# EAGLE design SparkFun_FT245-Breakout (EAGLE 7.2.0)
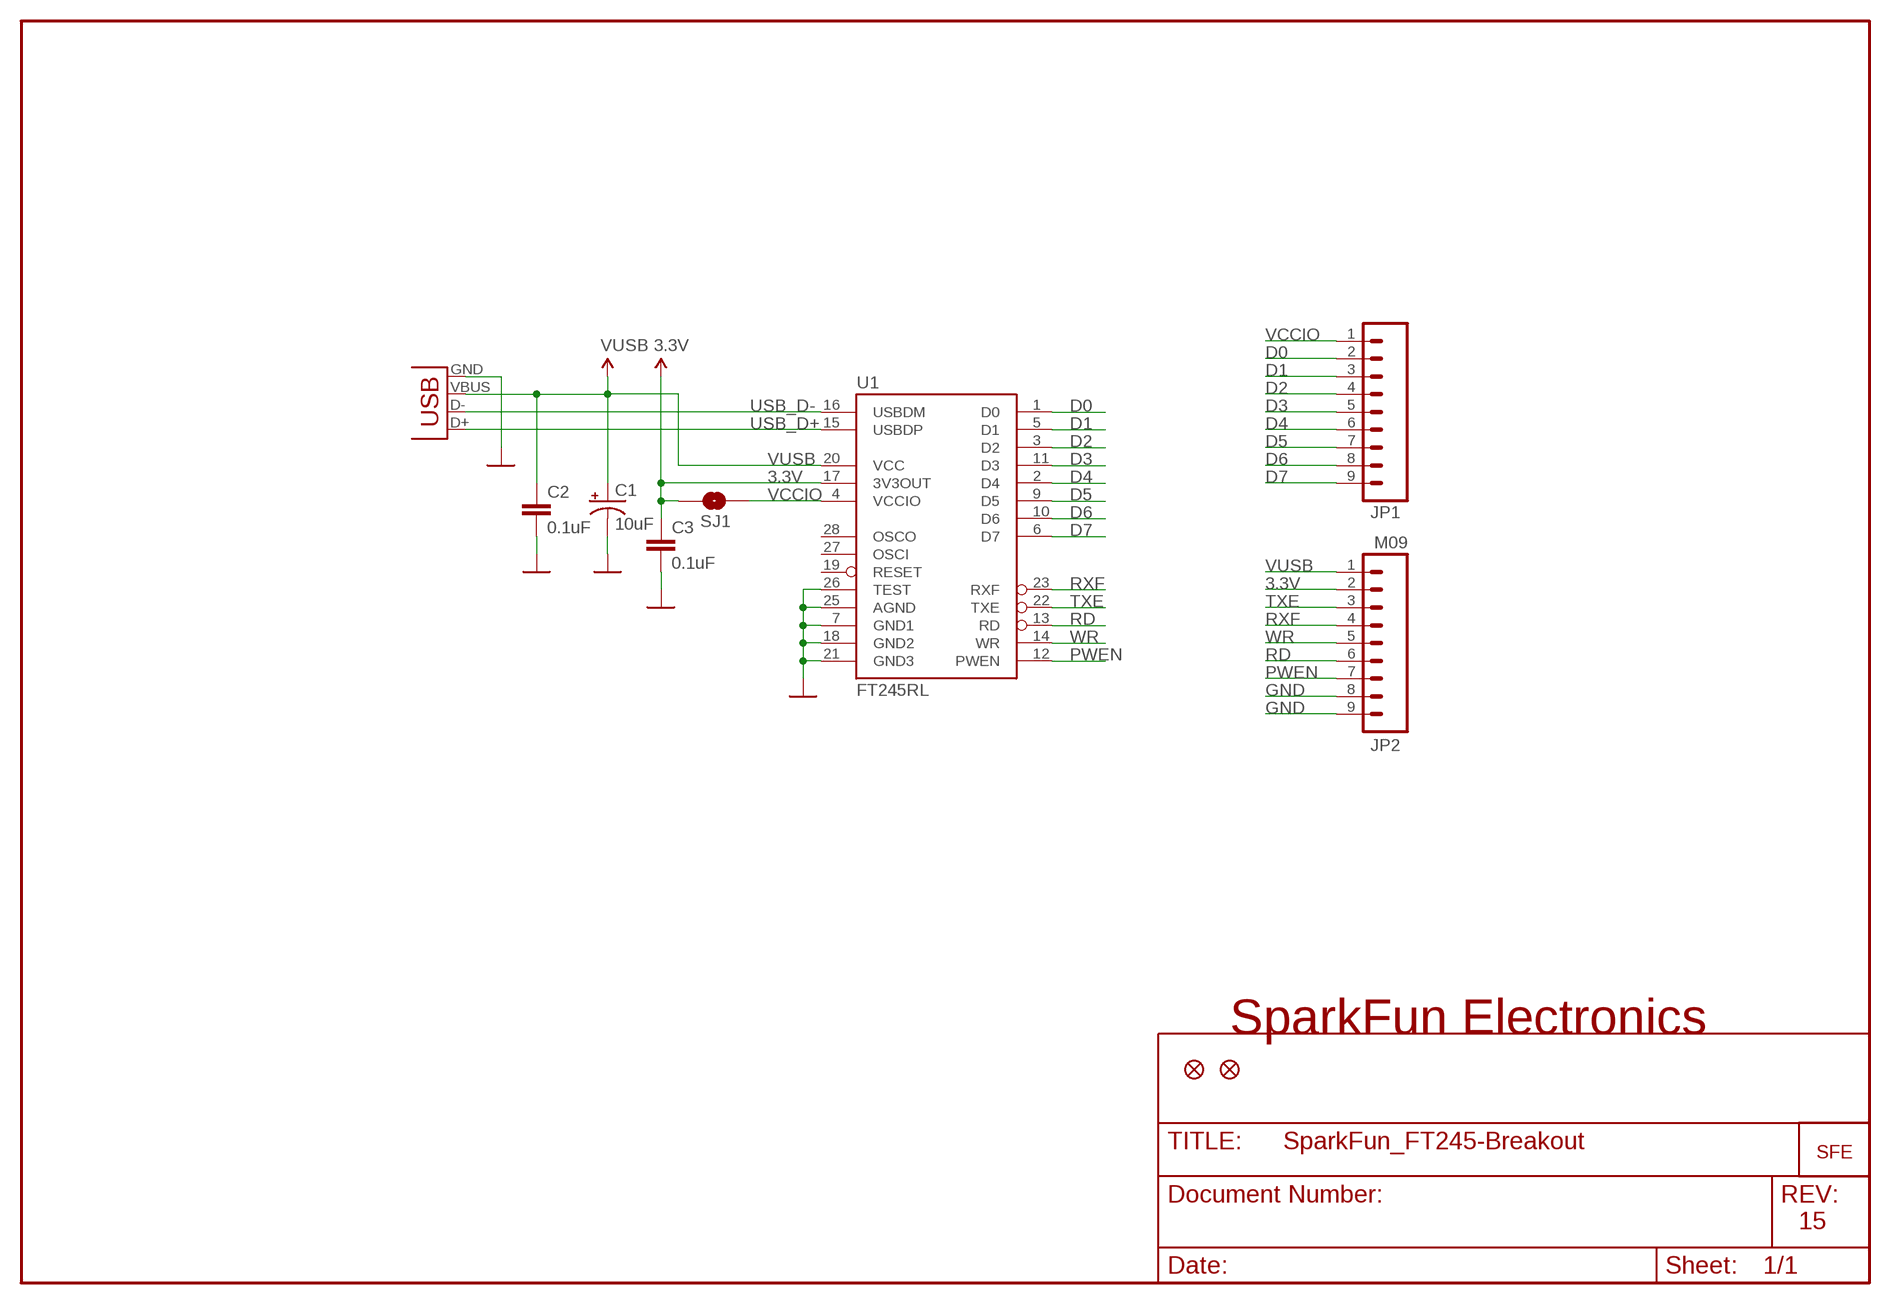
[diagram p0: schematic, sheet 1]

## Parts
C1  10uF  CAP_POL1206  [CPOL_1206]
C2  0.1uF  CAP0402-CAP  [0402-CAP]
C3  0.1uF  CAP0402-CAP  [0402-CAP]
JP1  M09  [1X09]
JP2  M09  [1X09]
JP3  FIDUCIAL1X2  [FIDUCIAL-1X2]
JP4  FIDUCIAL1X2  [FIDUCIAL-1X2]
SJ1  SOLDERJUMPERNC2  [SJ_2S-NOTRACE]
U1  FT245RL  [SSOP28DB]
U$1  LOGO-SFENEW  [SFE-NEW-WEBLOGO]
X2  USBSMD  [USB-MINIB]

## Nets
3.3V: C3.1 JP2.2 SJ1.1 U1.17(3V3OUT)
D0: JP1.2 U1.1(D0)
D1: JP1.3 U1.5(D1)
D2: JP1.4 U1.3(D2)
D3: JP1.5 U1.11(D3)
D4: JP1.6 U1.2(D4)
D5: JP1.7 U1.9(D5)
D6: JP1.8 U1.10(D6)
D7: JP1.9 U1.6(D7)
GND [power]: C1.C(-) C2.2 C3.2 JP2.8 JP2.9 U1.7(GND1) U1.18(GND2) U1.21(GND3) U1.25(AGND) U1.26(TEST) X2.GND
PWEN: JP2.7 U1.12(PWEN)
RD: JP2.6 U1.13(RD)
RXF: JP2.4 U1.23(RXF)
TXE: JP2.3 U1.22(TXE)
USB_D+: U1.15(USBDP) X2.D+
USB_D-: U1.16(USBDM) X2.D-
VCCIO: JP1.1 SJ1.2 U1.4(VCCIO)
VUSB [power]: C1.A(+) C2.1 JP2.1 U1.20(VCC) X2.VBUS
WR: JP2.5 U1.14(WR)
Unconnected: U1.19(RESET) U1.27(OSCI) U1.28(OSCO)

## Notes on the sheet
- SparkFun Electronics
- 15

## Library data of the parts
C1 = SparkFun-Nate:CAP_POL
C2 C3 = SparkFun:CAP: Capacitor Standard 0603 ceramic capacitor, and 0.1" leaded capacitor.
JP1 JP2 = SparkFun:M09: Header 9 Standard 9-pin 0.1" header. Use with straight break away headers (SKU : PRT-00116), right angle break away headers (PRT-00553), swiss pins (PRT-00743), machine pins (PRT-00117), and female headers (PRT-00115).
JP3 JP4 = SparkFun:FIDUCIAL: Fiducial Alignment Points Various fiducial points for machine vision alignment.
SJ1 = SparkFun:SOLDERJUMPER: Solder Jumper Standard SMD solder jumper. Used to automate production. Two varients : Normally Open and Normally Closed are the same, but have different paste layers. NC will have a large amount of paste and should jumper during reflow.
U1 = SparkFun:FT245RL: USB FIFO Controller 4th Generation USB Controller (USB <-> Parallel) - FIFO. Spark Fun Electronics SKU : COM-00787
U$1 = SparkFun:LOGO-SFE: Spark Fun Electronics PCB Logo This is the standard Spark Fun Electronics PCB logo.
X2 = SparkFun:USB: USB Connectors USB-B-PTH is fully proven SKU : PRT-00139 USB-miniB is fully proven SKU : PRT-00587 USB-A-PCB is untested. USB-A-H is throughly reviewed, but untested. Spark Fun Electronics SKU : PRT-00437 USB-B-SMT is throughly reviewed, but untested. Needs silkscreen touching up. USB-A-S has not been used/tested USB-MB-H has not been used/tested

## Net classes
0 default: width 0.203 mm
1 power: width 0.254 mm

## Board
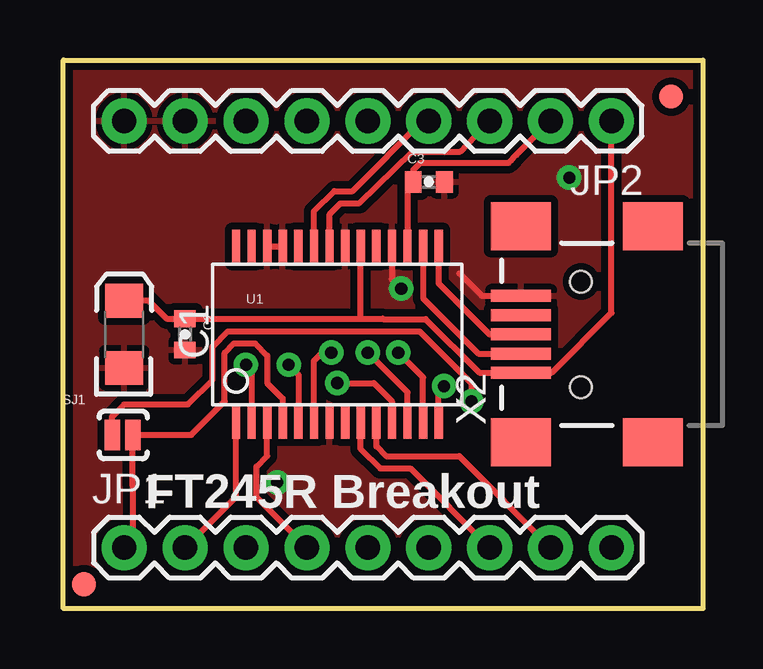
[diagram p1: board, top side]
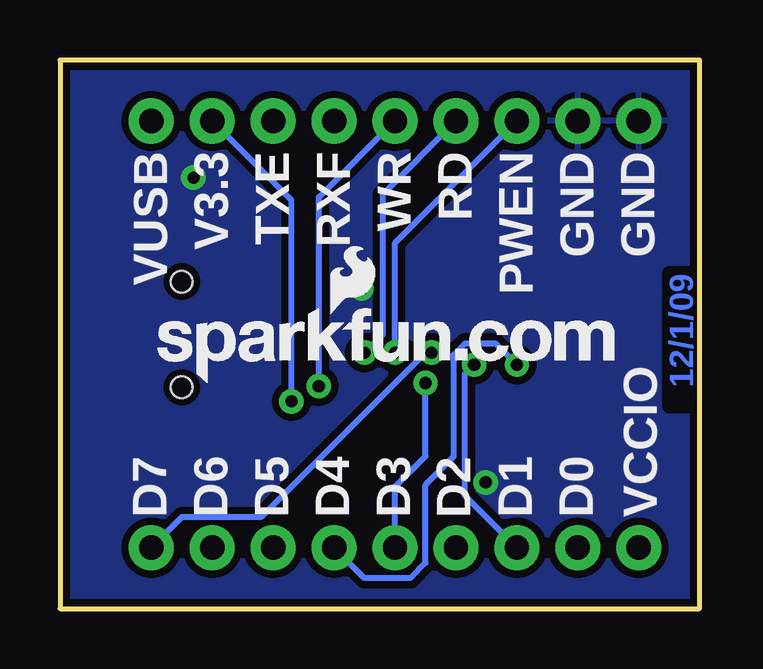
[diagram p2: board, bottom side, seen from below]

Size 26.67 x 22.86 mm. Coordinates in mm from the lower left corner, seen from the top.
Outline: 0,22.86 26.67,22.86 26.67,0 0,0 0,22.86
Copper layers (1*16): Top 0.035mm / dielectric 1.5mm / Bottom 0.035mm
Design rules "SparkFun": minimum track width 8mil, minimum drill 20mil, track to track 8mil, track to pad 8mil, pad to pad 8mil, via to via 8mil, smd to smd 8mil, copper to edge 10mil, drill to drill 8mil, minimum pad ring 12mil, minimum via ring 10mil, stop-mask expansion 4mil, vias tented up to drill 25mil, thermal gap 10mil

### Footprints (pad centres in the part's own frame; a part is rotated, then mirrored left to right if it is on the bottom)
CPOL_1206 = smd 1.6 x 1.4: A 0,-1.4; C 0,1.4
0402-CAP = smd 0.7 x 0.9: 1 -0.65,0; 2 0.65,0
1X09 = drill 1.016 pad 1.88: 1 0,0; 2 2.54,0; 3 5.08,0; 4 7.62,0; 5 10.16,0; 6 12.7,0; 7 15.24,0; 8 17.78,0; 9 20.32,0
FIDUCIAL-1X2 = smd 1 x 1: 1 0,0
SJ_2S-NOTRACE = smd 0.635 x 1.27: 1 -0.45,0; 2 0.4,0
SSOP28DB = smd 0.348 x 1.397: 1 -4.225,-3.656; 2 -3.575,-3.656; 3 -2.925,-3.656; 4 -2.275,-3.656; 5 -1.625,-3.656; 6 -0.975,-3.656; 7 -0.325,-3.656; 8 0.325,-3.656; 9 0.975,-3.656; 10 1.625,-3.656; 11 2.275,-3.656; 12 2.925,-3.656; 13 3.575,-3.656; 14 4.225,-3.656; 15 4.225,3.656; 16 3.575,3.656; 17 2.925,3.656; 18 2.275,3.656; 19 1.625,3.656; 20 0.975,3.656; 21 0.325,3.656; 22 -0.325,3.656; 23 -0.975,3.656; 24 -1.625,3.656; 25 -2.275,3.656; 26 -2.925,3.656; 27 -3.575,3.656; 28 -4.225,3.656
USB-MINIB = smd 2.5 x 0.5: D+ 2.5,0; D- 2.5,0.8; GND 2.5,-1.6; ID 2.5,-0.8; VBUS 2.5,1.6 | smd 2.5 x 2: GND@1 -3,-4.5; GND@2 -3,4.5; GND@3 2.5,4.5; GND@4 2.5,-4.5 | hole 0.9: 0,2.2; 0,-2.2

### Placement (x,y rotation side)
C1  2.54,11.43 180 top
C2  5.08,11.43 270 top
C3  15.24,17.78 0 top
JP1  2.54,2.54 0 top
JP2  22.86,20.32 180 top
JP3  0.86,1.02 0 top
JP4  25.35,21.34 0 top
SJ1  2.5,7.24 0 top
U1  11.43,11.43 0 top
U$1  22.61,9.4 0 bottom
X2  21.59,11.43 180 top

### Tracks (layer width: path | path; a pad name or v marks a point on that pad's centre or on a via)
3.3V  (via drill 0.51)
  Top 0.254: SJ1.1 2.03,8 2.54,8.51 5.21,8.51 6.22,9.53 6.22,10.92 6.86,11.56 14.86,11.56 17.02,9.4 v17.02,8.64 | U1.17 14.36,17.53 14.61,17.78 C3.1 14.59,18.27 14.88,18.57 18.57,18.57 18.9,18.9 | JP2.2 18.9,18.9 | 18.9,18.9 18.67,18.67
  Bottom 0.254: v17.02,8.64 17.02,17.02 JP2.2
D0
  Top 0.254: U1.1 7.21,4.67 JP1.2
D1  (via drill 0.51)
  Top 0.254: U1.5 9.8,9.75 v9.4,10.16
  Bottom 0.254: v9.4,10.16 9.79,9.77 9.79,4.71 JP1.3
D2
  Top 0.254: JP1.4 8.06,4.64 8.06,5.92 8.51,6.36 U1.3
D3  (via drill 0.51)
  Top 0.254: U1.11 13.71,8.65 12.95,9.4 v11.43,9.4
  Bottom 0.254: v11.43,9.4 11.43,6.35 12.7,5.08 JP1.5
D4  (via drill 0.51)
  Top 0.254: U1.2 7.86,9.93 v7.62,10.16
  Bottom 0.254: v7.62,10.16 8.51,11.05 9.78,11.05 10.25,10.58 10.25,6.34 11.43,5.16 11.43,1.91 12.06,1.27 13.97,1.27 JP1.6
D5
  Top 0.254: U1.9 12.4,6.64 13.21,5.84 14.48,5.84 JP1.7
D6
  Top 0.254: U1.10 13.05,6.76 13.46,6.35 16.51,6.35 JP1.8
D7  (via drill 0.51)
  Top 0.254: v11.18,10.67 10.79,10.67 10.46,10.33 U1.6
  Bottom 0.254: v11.18,10.67 11.43,10.67 18.29,3.81 21.59,3.81 JP1.9
GND  (via drill 0.51)
  Top 0.254: U1.26 8.51,14.99 8.61,15.09 U1.25 | X2.GND 17.45,13.03 16.51,13.97 | U1.18 13.71,13.73 v14.1,13.34
  other vias: 8.92,5.26 21.1,17.96
  pour Bottom (isolate 0.305): 0,0 0,22.86 26.67,22.86 26.67,0
  pour Top (isolate 0.305): 0,0 0,22.86 26.67,22.86 26.67,0
PWEN  (via drill 0.51)
  Top 0.254: U1.12 14.36,9.01 v12.7,10.67
  Bottom 0.254: v12.7,10.67 12.7,15.24 JP2.7
RD  (via drill 0.51)
  Top 0.254: U1.13 15.01,9.63 v13.97,10.67
  Bottom 0.254: v13.97,10.67 13.21,11.43 13.21,17.27 JP2.6
RXF
  Top 0.254: U1.23 10.46,16.55 11.3,17.4 12.06,17.4 14.99,20.32 JP2.4
TXE
  Top 0.254: U1.22 11.11,16.44 11.56,16.89 12.35,16.9 14.56,19.04 16.56,19.04 JP2.3
USB_D+
  Top 0.254: X2.D+ 17.78,11.43 15.65,13.55 U1.15
USB_D-
  Top 0.254: X2.D- 17.31,10.63 15.01,12.94 U1.16
VCCIO
  Top 0.254: U1.4 9.15,8.75 8.51,9.4 8.51,10.54 8,11.05 7.11,11.05 6.73,10.67 6.73,8.64 5.33,7.24 SJ1.2 2.92,2.92 JP1.1
VUSB
  Top 0.254: 12.45,12.08 C2.1 4.3,12.08 3.55,12.83 C1.A | 12.45,12.08 13.32,12.08 13.34,12.06 15.11,12.06 17.35,9.83 X2.VBUS 20.37,9.83 22.86,12.32 JP2.1 | 12.45,12.08 12.45,12.06 12.4,12.11 U1.20
WR  (via drill 0.51)
  Top 0.254: U1.14 15.65,9.05 v15.88,9.27
  Bottom 0.254: v15.88,9.27 15.88,17.14 JP2.5

### Text on the board
Bottom: 12/1/09
tPlace: FT245R Breakout
bPlace: GND | GND | PWEN | RD | WR | RXF | TXE | V3.3 | VUSB | VCCIO | D0 | D1 | D2 | D3 | D4 | D5 | D6 | D7